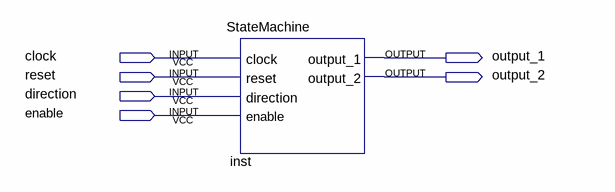
[diagram p0: schematic sheet]
// Quartus schematic Diagram.bdf as structural Verilog: 1 symbols, 6 pins
module Diagram (
  input  clock,
  input  reset,
  input  direction,
  input  enable,
  output output_1,
  output output_2
);

  StateMachine inst (
    .clock(clock), .reset(reset), .direction(direction), .enable(enable), .output_1(output_1),
    .output_2(output_2));
endmodule
